# Altium schematic sheet TopLevelDesgin.SchDoc
size A; SheetNumber: 1; SheetTotal: 2
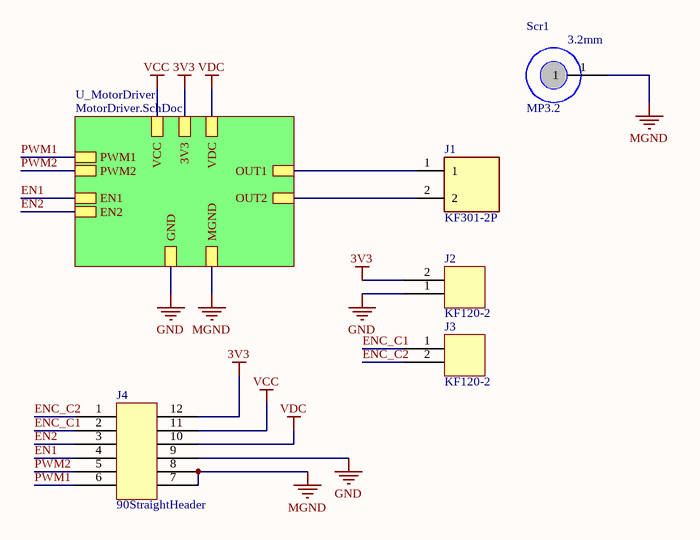
[diagram p0: TopLevelDesgin.SchDoc]

## Parts
J1  KF301-2P  [HANDSON_KF301-2P]
J2  KF120-2  [KF120-2-Footprint-1]
J3  KF120-2  [KF120-2-Footprint-1]
J4  90StraightHeader  [Header90Degree]
Scr1  MP3.2  [MP3.2]

## Sub-sheets
U_MotorDriver = MotorDriver.SchDoc: PWM1, PWM2, OUT1, OUT2, 3V3, VCC, GND, VDC, MGND, EN1, EN2

## Nets
3V3: J2.2 J4.12 ; sheet U_MotorDriver/3V3
GND: J2.1 J4.9 ; sheet U_MotorDriver/GND
MGND: J4.7 J4.8 Scr1.1 ; sheet U_MotorDriver/MGND
VCC: J4.11 ; sheet U_MotorDriver/VCC
VDC: J4.10 ; sheet U_MotorDriver/VDC
EN1: J4.4 ; sheet U_MotorDriver/EN1
EN2: J4.3 ; sheet U_MotorDriver/EN2
ENC_C1: J3.1 J4.2
ENC_C2: J3.2 J4.1
PWM1: J4.6 ; sheet U_MotorDriver/PWM1
PWM2: J4.5 ; sheet U_MotorDriver/PWM2
NetJ1_1: J1.1 ; sheet U_MotorDriver/OUT1
NetJ1_2: J1.2 ; sheet U_MotorDriver/OUT2

## Notes on the sheet
- (in symbol CMP-143-000000-1) 3.2mm

## Library data of the parts
J1 = CMP-118-000001-1: 2 Pin Terminal Block 5mm Pitch; MP: KF301-2P; Design Item ID: KF301-2P; Value: *; Price: None; Package: None; Availability: Unavailable; Source: KF301-2P.SchLib
J2 J3 = CMP-118-000003-2: 2.54mm Terminal
J4 = CMP-118-000004-6: System: Connector
Scr1 = CMP-143-000000-1: Component Type: Standard; Pin Count: 1; Source: MP_3P2.SchLib; Design Item ID: MP3.2